# Altium schematic sheet Motor3_PCIe.SchDoc
size B
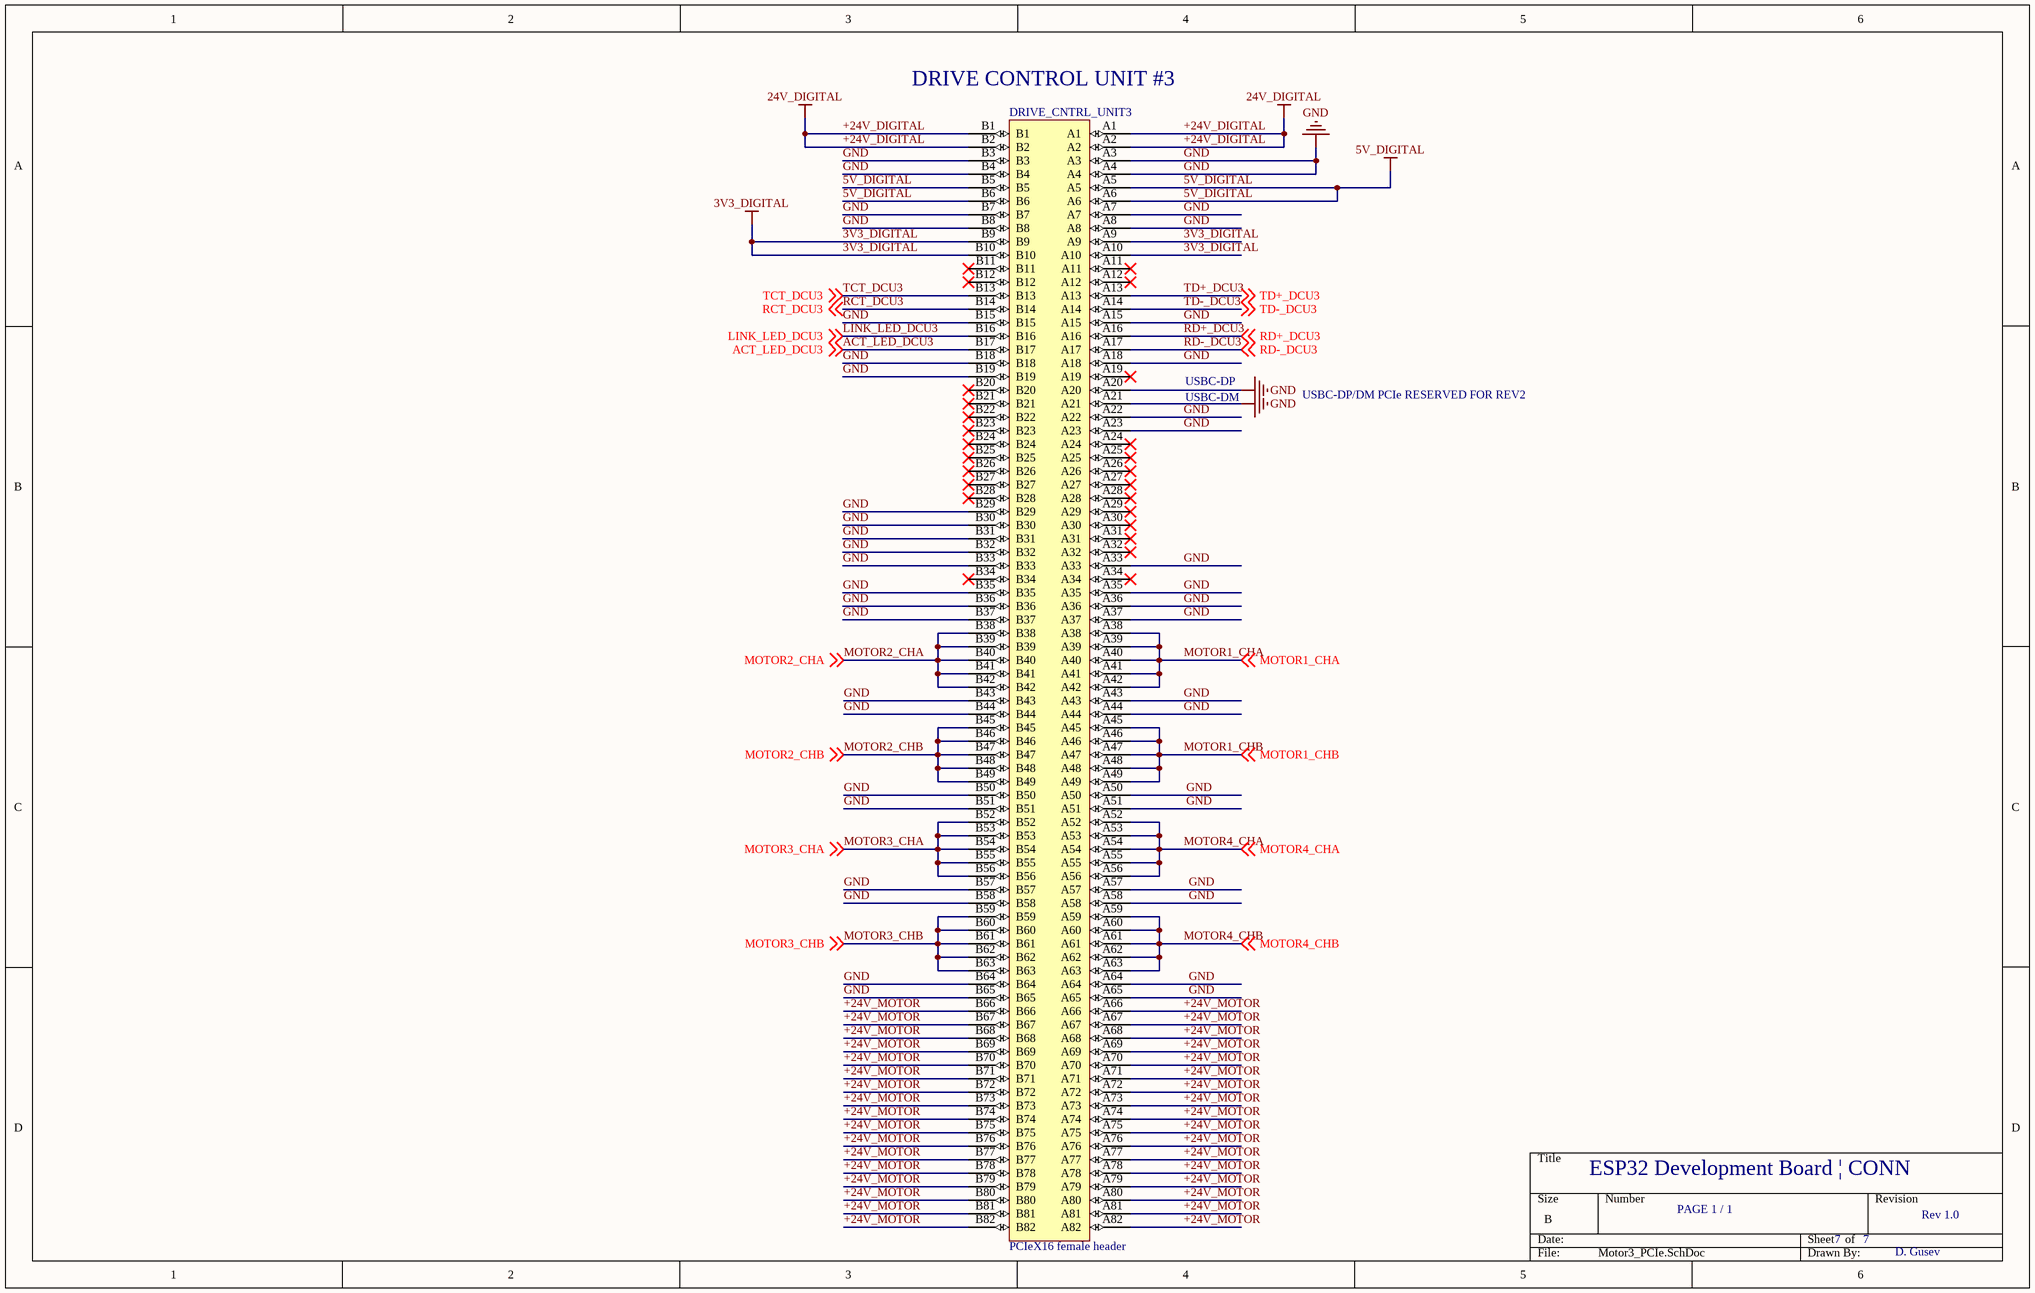
[diagram p0: Motor3_PCIe.SchDoc]

## Parts
DRIVE_CNTRL_UNIT3  PCIeX16 female header  [SAMTEC_PCIE-164-02-X-D-TH]

## Nets
3V3_DIGITAL: DRIVE_CNTRL_UNIT3.A9 DRIVE_CNTRL_UNIT3.A10 DRIVE_CNTRL_UNIT3.B9 DRIVE_CNTRL_UNIT3.B10
5V_DIGITAL: DRIVE_CNTRL_UNIT3.A5 DRIVE_CNTRL_UNIT3.A6 DRIVE_CNTRL_UNIT3.B5 DRIVE_CNTRL_UNIT3.B6
+24V_DIGITAL: DRIVE_CNTRL_UNIT3.A1 DRIVE_CNTRL_UNIT3.A2 DRIVE_CNTRL_UNIT3.B1 DRIVE_CNTRL_UNIT3.B2  [also labelled 24V_DIGITAL]
GND: DRIVE_CNTRL_UNIT3.A3 DRIVE_CNTRL_UNIT3.A4 DRIVE_CNTRL_UNIT3.A7 DRIVE_CNTRL_UNIT3.A8 DRIVE_CNTRL_UNIT3.A15 DRIVE_CNTRL_UNIT3.A18 DRIVE_CNTRL_UNIT3.A20 DRIVE_CNTRL_UNIT3.A21 DRIVE_CNTRL_UNIT3.A22 DRIVE_CNTRL_UNIT3.A23 DRIVE_CNTRL_UNIT3.A33 DRIVE_CNTRL_UNIT3.A35 DRIVE_CNTRL_UNIT3.A36 DRIVE_CNTRL_UNIT3.A37 DRIVE_CNTRL_UNIT3.A43 DRIVE_CNTRL_UNIT3.A44 DRIVE_CNTRL_UNIT3.A50 DRIVE_CNTRL_UNIT3.A51 DRIVE_CNTRL_UNIT3.A57 DRIVE_CNTRL_UNIT3.A58 DRIVE_CNTRL_UNIT3.A64 DRIVE_CNTRL_UNIT3.A65 DRIVE_CNTRL_UNIT3.B3 DRIVE_CNTRL_UNIT3.B4 DRIVE_CNTRL_UNIT3.B7 DRIVE_CNTRL_UNIT3.B8 DRIVE_CNTRL_UNIT3.B15 DRIVE_CNTRL_UNIT3.B18 DRIVE_CNTRL_UNIT3.B19 DRIVE_CNTRL_UNIT3.B29 DRIVE_CNTRL_UNIT3.B30 DRIVE_CNTRL_UNIT3.B31 DRIVE_CNTRL_UNIT3.B32 DRIVE_CNTRL_UNIT3.B33 DRIVE_CNTRL_UNIT3.B35 DRIVE_CNTRL_UNIT3.B36 DRIVE_CNTRL_UNIT3.B37 DRIVE_CNTRL_UNIT3.B43 DRIVE_CNTRL_UNIT3.B44 DRIVE_CNTRL_UNIT3.B50 DRIVE_CNTRL_UNIT3.B51 DRIVE_CNTRL_UNIT3.B57 DRIVE_CNTRL_UNIT3.B58 DRIVE_CNTRL_UNIT3.B64 DRIVE_CNTRL_UNIT3.B65
+24V_MOTOR: DRIVE_CNTRL_UNIT3.A66 DRIVE_CNTRL_UNIT3.A67 DRIVE_CNTRL_UNIT3.A68 DRIVE_CNTRL_UNIT3.A69 DRIVE_CNTRL_UNIT3.A70 DRIVE_CNTRL_UNIT3.A71 DRIVE_CNTRL_UNIT3.A72 DRIVE_CNTRL_UNIT3.A73 DRIVE_CNTRL_UNIT3.A74 DRIVE_CNTRL_UNIT3.A75 DRIVE_CNTRL_UNIT3.A76 DRIVE_CNTRL_UNIT3.A77 DRIVE_CNTRL_UNIT3.A78 DRIVE_CNTRL_UNIT3.A79 DRIVE_CNTRL_UNIT3.A80 DRIVE_CNTRL_UNIT3.A81 DRIVE_CNTRL_UNIT3.A82 DRIVE_CNTRL_UNIT3.B66 DRIVE_CNTRL_UNIT3.B67 DRIVE_CNTRL_UNIT3.B68 DRIVE_CNTRL_UNIT3.B69 DRIVE_CNTRL_UNIT3.B70 DRIVE_CNTRL_UNIT3.B71 DRIVE_CNTRL_UNIT3.B72 DRIVE_CNTRL_UNIT3.B73 DRIVE_CNTRL_UNIT3.B74 DRIVE_CNTRL_UNIT3.B75 DRIVE_CNTRL_UNIT3.B76 DRIVE_CNTRL_UNIT3.B77 DRIVE_CNTRL_UNIT3.B78 DRIVE_CNTRL_UNIT3.B79 DRIVE_CNTRL_UNIT3.B80 DRIVE_CNTRL_UNIT3.B81 DRIVE_CNTRL_UNIT3.B82
ACT_LED_DCU3: DRIVE_CNTRL_UNIT3.B17 ; off-sheet ACT_LED_DCU3
LINK_LED_DCU3: DRIVE_CNTRL_UNIT3.B16 ; off-sheet LINK_LED_DCU3
MOTOR1_CHA: DRIVE_CNTRL_UNIT3.A38 DRIVE_CNTRL_UNIT3.A39 DRIVE_CNTRL_UNIT3.A40 DRIVE_CNTRL_UNIT3.A41 DRIVE_CNTRL_UNIT3.A42 ; off-sheet MOTOR1_CHA
MOTOR1_CHB: DRIVE_CNTRL_UNIT3.A45 DRIVE_CNTRL_UNIT3.A46 DRIVE_CNTRL_UNIT3.A47 DRIVE_CNTRL_UNIT3.A48 DRIVE_CNTRL_UNIT3.A49 ; off-sheet MOTOR1_CHB
MOTOR2_CHA: DRIVE_CNTRL_UNIT3.B38 DRIVE_CNTRL_UNIT3.B39 DRIVE_CNTRL_UNIT3.B40 DRIVE_CNTRL_UNIT3.B41 DRIVE_CNTRL_UNIT3.B42 ; off-sheet MOTOR2_CHA
MOTOR2_CHB: DRIVE_CNTRL_UNIT3.B45 DRIVE_CNTRL_UNIT3.B46 DRIVE_CNTRL_UNIT3.B47 DRIVE_CNTRL_UNIT3.B48 DRIVE_CNTRL_UNIT3.B49 ; off-sheet MOTOR2_CHB
MOTOR3_CHA: DRIVE_CNTRL_UNIT3.B52 DRIVE_CNTRL_UNIT3.B53 DRIVE_CNTRL_UNIT3.B54 DRIVE_CNTRL_UNIT3.B55 DRIVE_CNTRL_UNIT3.B56 ; off-sheet MOTOR3_CHA
MOTOR3_CHB: DRIVE_CNTRL_UNIT3.B59 DRIVE_CNTRL_UNIT3.B60 DRIVE_CNTRL_UNIT3.B61 DRIVE_CNTRL_UNIT3.B62 DRIVE_CNTRL_UNIT3.B63 ; off-sheet MOTOR3_CHB
MOTOR4_CHA: DRIVE_CNTRL_UNIT3.A52 DRIVE_CNTRL_UNIT3.A53 DRIVE_CNTRL_UNIT3.A54 DRIVE_CNTRL_UNIT3.A55 DRIVE_CNTRL_UNIT3.A56 ; off-sheet MOTOR4_CHA
MOTOR4_CHB: DRIVE_CNTRL_UNIT3.A59 DRIVE_CNTRL_UNIT3.A60 DRIVE_CNTRL_UNIT3.A61 DRIVE_CNTRL_UNIT3.A62 DRIVE_CNTRL_UNIT3.A63 ; off-sheet MOTOR4_CHB
RCT_DCU3: DRIVE_CNTRL_UNIT3.B14 ; off-sheet RCT_DCU3
RD+_DCU3: DRIVE_CNTRL_UNIT3.A16 ; off-sheet RD+_DCU3
RD-_DCU3: DRIVE_CNTRL_UNIT3.A17 ; off-sheet RD-_DCU3
TCT_DCU3: DRIVE_CNTRL_UNIT3.B13 ; off-sheet TCT_DCU3
TD+_DCU3: DRIVE_CNTRL_UNIT3.A13 ; off-sheet TD+_DCU3
TD-_DCU3: DRIVE_CNTRL_UNIT3.A14 ; off-sheet TD-_DCU3

Not connected (* = marked no-connect by the designer): DRIVE_CNTRL_UNIT3 A11* A12* A19* A24* A25* A26* A27* A28* A29* A30* A31* A32* A34* B11* B12* B20* B21* B22* B23* B24* B25* B26* B27* B28* B34*

## Notes on the sheet
- (near DRIVE_CNTRL_UNIT3) DRIVE CONTROL UNIT #3
- USBC-DP
- USBC-DM
- USBC-DP/DM PCIe RESERVED FOR REV2
- ESP32 Development Board | CONN
- PAGE 1 / 1
- 7
- Rev 1.0
- D. Gusev

## Library data of the parts
DRIVE_CNTRL_UNIT3 = PCIeX16 female header: 164-position SAMTEC female header